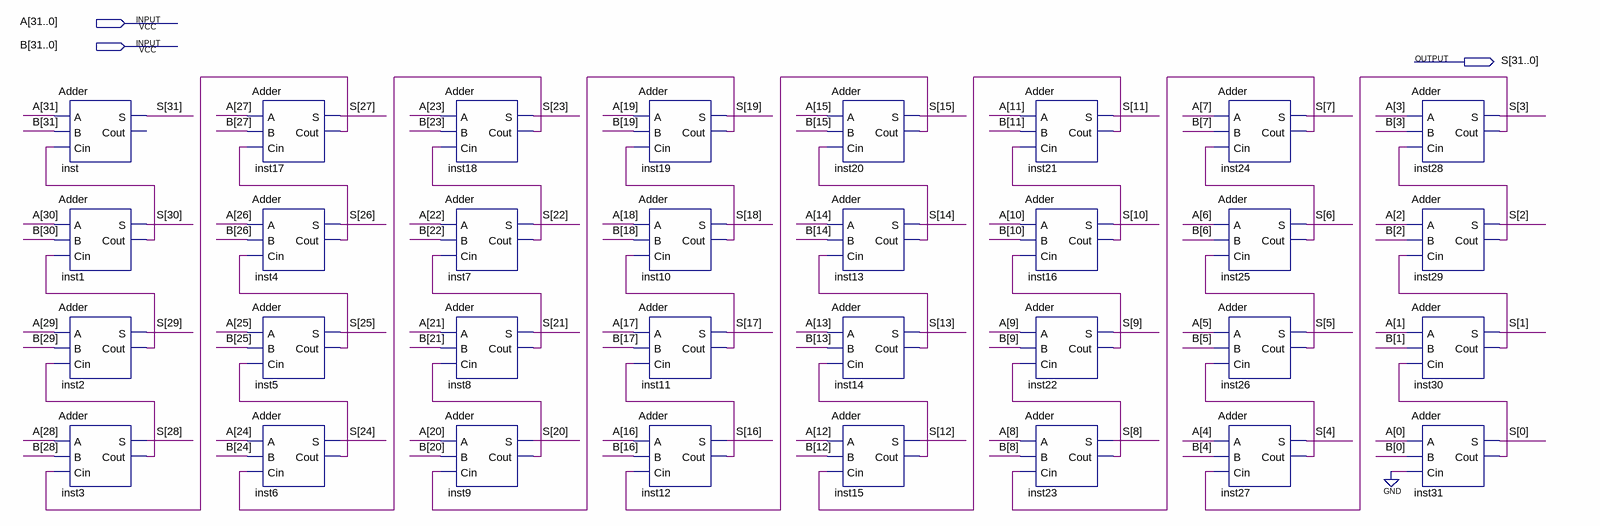
[diagram p0: schematic sheet]
// Quartus schematic Adder32.bdf as structural Verilog: 32 symbols, 3 pins
module Adder32 (
  input  [31:0] A,
  input  [31:0] B,
  output [31:0] S
);

  wire inst1_cout, inst2_cout, inst3_cout, inst4_cout, inst5_cout, inst6_cout, inst7_cout, inst8_cout,
       inst9_cout, inst10_cout, inst11_cout, inst12_cout, inst13_cout, inst14_cout, inst15_cout, inst16_cout,
       inst17_cout, inst18_cout, inst19_cout, inst20_cout, inst21_cout, inst22_cout, inst23_cout,
       inst24_cout, inst25_cout, inst26_cout, inst27_cout, inst28_cout, inst29_cout, inst30_cout, inst31_cout;

  Adder inst (.A(A[31]), .B(B[31]), .Cin(inst1_cout), .S(S[31]));  // open: Cout
  Adder inst1 (.A(A[30]), .B(B[30]), .Cin(inst2_cout), .S(S[30]), .Cout(inst1_cout));
  Adder inst2 (.A(A[29]), .B(B[29]), .Cin(inst3_cout), .S(S[29]), .Cout(inst2_cout));
  Adder inst3 (.A(A[28]), .B(B[28]), .Cin(inst17_cout), .S(S[28]), .Cout(inst3_cout));
  Adder inst17 (.A(A[27]), .B(B[27]), .Cin(inst4_cout), .S(S[27]), .Cout(inst17_cout));
  Adder inst4 (.A(A[26]), .B(B[26]), .Cin(inst5_cout), .S(S[26]), .Cout(inst4_cout));
  Adder inst5 (.A(A[25]), .B(B[25]), .Cin(inst6_cout), .S(S[25]), .Cout(inst5_cout));
  Adder inst6 (.A(A[24]), .B(B[24]), .Cin(inst18_cout), .S(S[24]), .Cout(inst6_cout));
  Adder inst18 (.A(A[23]), .B(B[23]), .Cin(inst7_cout), .S(S[23]), .Cout(inst18_cout));
  Adder inst7 (.A(A[22]), .B(B[22]), .Cin(inst8_cout), .S(S[22]), .Cout(inst7_cout));
  Adder inst8 (.A(A[21]), .B(B[21]), .Cin(inst9_cout), .S(S[21]), .Cout(inst8_cout));
  Adder inst9 (.A(A[20]), .B(B[20]), .Cin(inst19_cout), .S(S[20]), .Cout(inst9_cout));
  Adder inst19 (.A(A[19]), .B(B[19]), .Cin(inst10_cout), .S(S[19]), .Cout(inst19_cout));
  Adder inst10 (.A(A[18]), .B(B[18]), .Cin(inst11_cout), .S(S[18]), .Cout(inst10_cout));
  Adder inst11 (.A(A[17]), .B(B[17]), .Cin(inst12_cout), .S(S[17]), .Cout(inst11_cout));
  Adder inst12 (.A(A[16]), .B(B[16]), .Cin(inst20_cout), .S(S[16]), .Cout(inst12_cout));
  Adder inst20 (.A(A[15]), .B(B[15]), .Cin(inst13_cout), .S(S[15]), .Cout(inst20_cout));
  Adder inst13 (.A(A[14]), .B(B[14]), .Cin(inst14_cout), .S(S[14]), .Cout(inst13_cout));
  Adder inst14 (.A(A[13]), .B(B[13]), .Cin(inst15_cout), .S(S[13]), .Cout(inst14_cout));
  Adder inst15 (.A(A[12]), .B(B[12]), .Cin(inst21_cout), .S(S[12]), .Cout(inst15_cout));
  Adder inst21 (.A(A[11]), .B(B[11]), .Cin(inst16_cout), .S(S[11]), .Cout(inst21_cout));
  Adder inst16 (.A(A[10]), .B(B[10]), .Cin(inst22_cout), .S(S[10]), .Cout(inst16_cout));
  Adder inst22 (.A(A[9]), .B(B[9]), .Cin(inst23_cout), .S(S[9]), .Cout(inst22_cout));
  Adder inst23 (.A(A[8]), .B(B[8]), .Cin(inst24_cout), .S(S[8]), .Cout(inst23_cout));
  Adder inst24 (.A(A[7]), .B(B[7]), .Cin(inst25_cout), .S(S[7]), .Cout(inst24_cout));
  Adder inst25 (.A(A[6]), .B(B[6]), .Cin(inst26_cout), .S(S[6]), .Cout(inst25_cout));
  Adder inst26 (.A(A[5]), .B(B[5]), .Cin(inst27_cout), .S(S[5]), .Cout(inst26_cout));
  Adder inst27 (.A(A[4]), .B(B[4]), .Cin(inst28_cout), .S(S[4]), .Cout(inst27_cout));
  Adder inst28 (.A(A[3]), .B(B[3]), .Cin(inst29_cout), .S(S[3]), .Cout(inst28_cout));
  Adder inst29 (.A(A[2]), .B(B[2]), .Cin(inst30_cout), .S(S[2]), .Cout(inst29_cout));
  Adder inst30 (.A(A[1]), .B(B[1]), .Cin(inst31_cout), .S(S[1]), .Cout(inst30_cout));
  Adder inst31 (.A(A[0]), .B(B[0]), .Cin(1'b0), .S(S[0]), .Cout(inst31_cout));
endmodule
